# Altium schematic sheet MIDI_Synthesizer.SchDoc
size A2; SheetNumber: 1; SheetTotal: 2
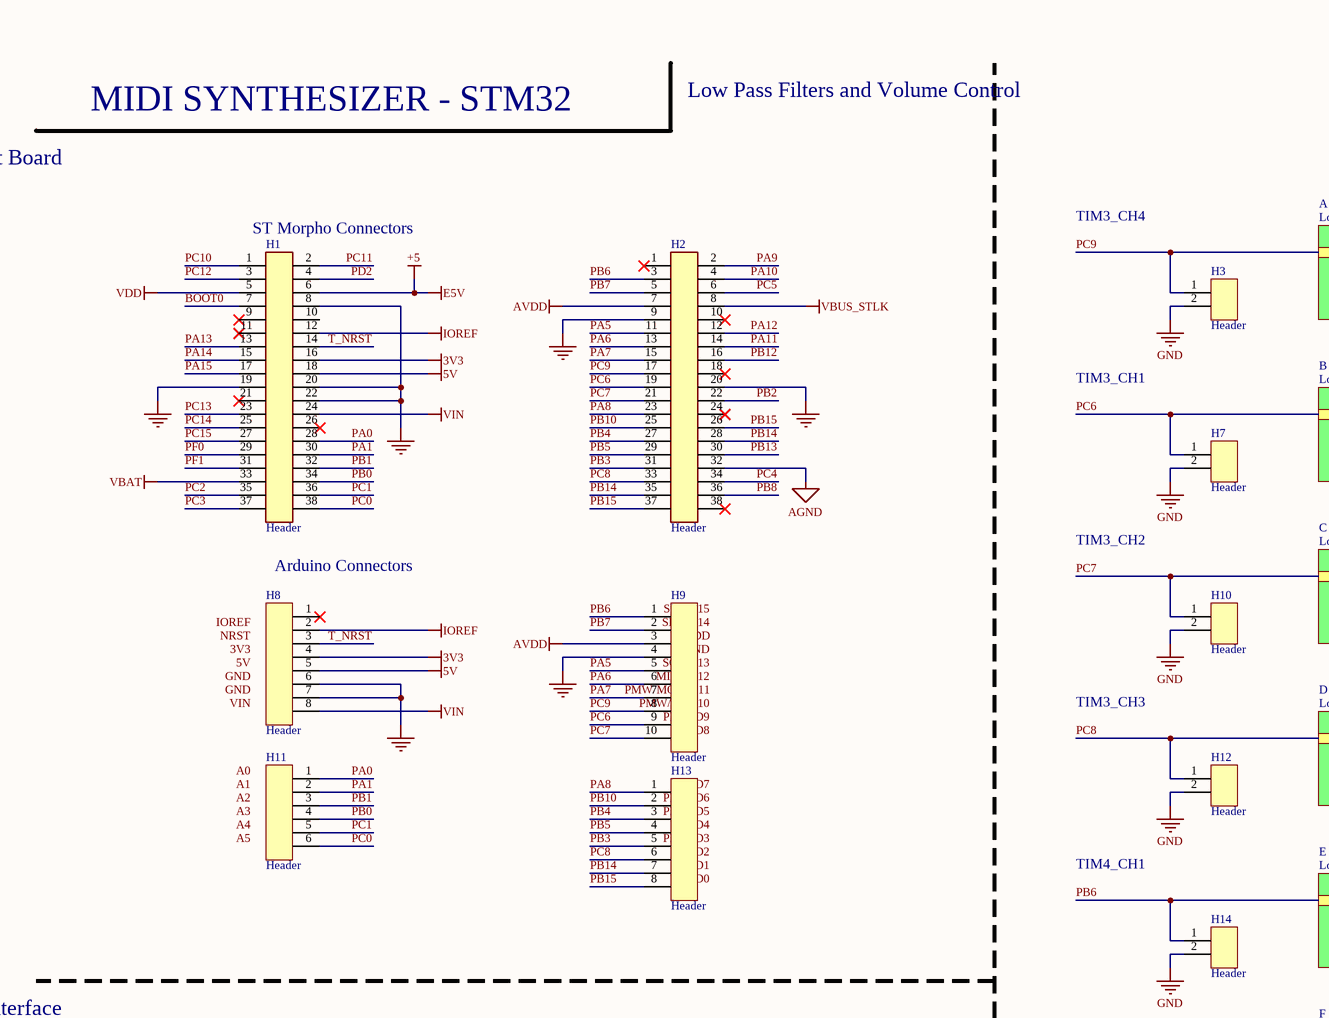
[diagram p0: MIDI_Synthesizer.SchDoc, top left]
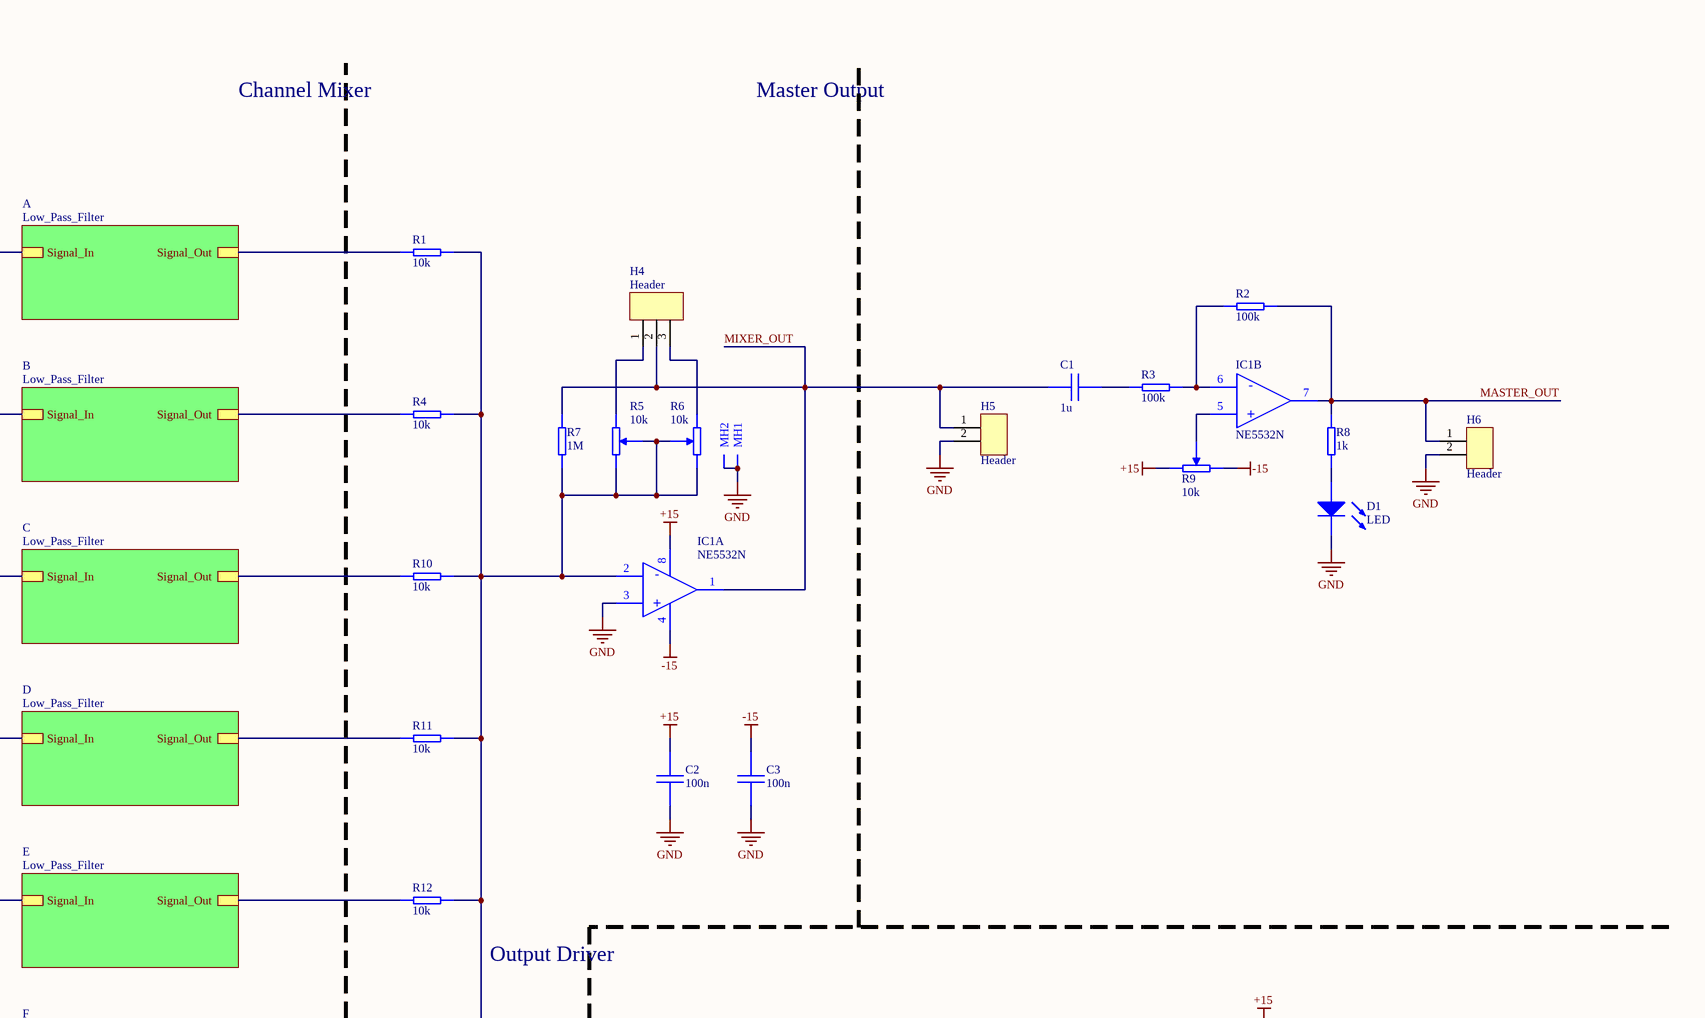
[diagram p1: MIDI_Synthesizer.SchDoc, top right]
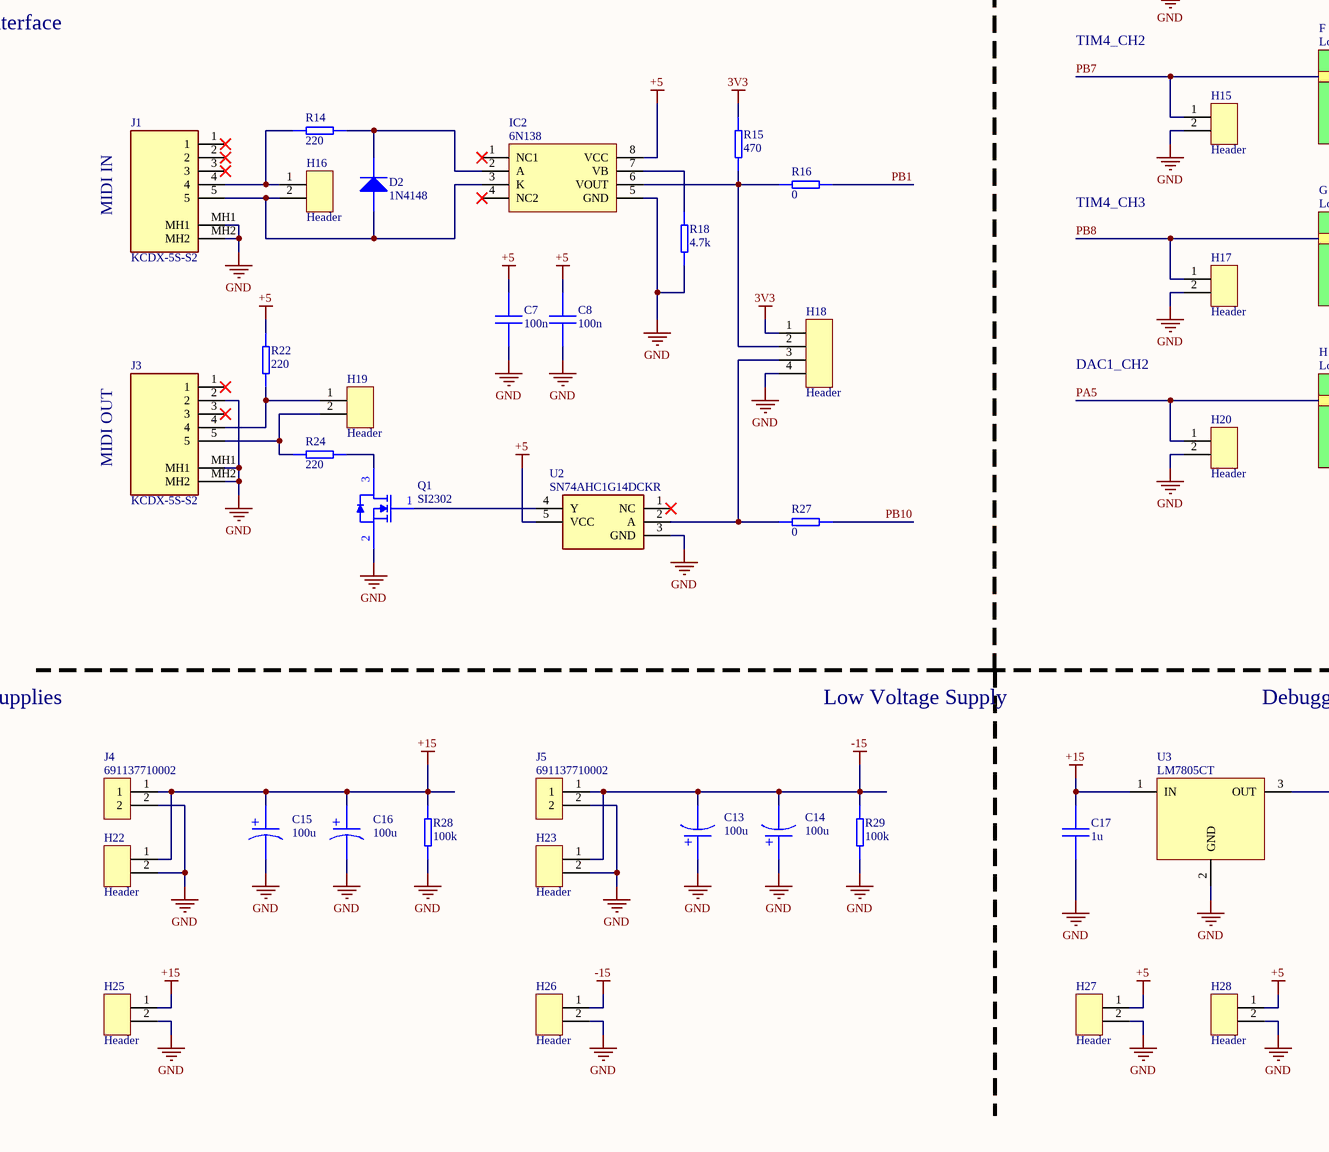
[diagram p2: MIDI_Synthesizer.SchDoc, bottom left]
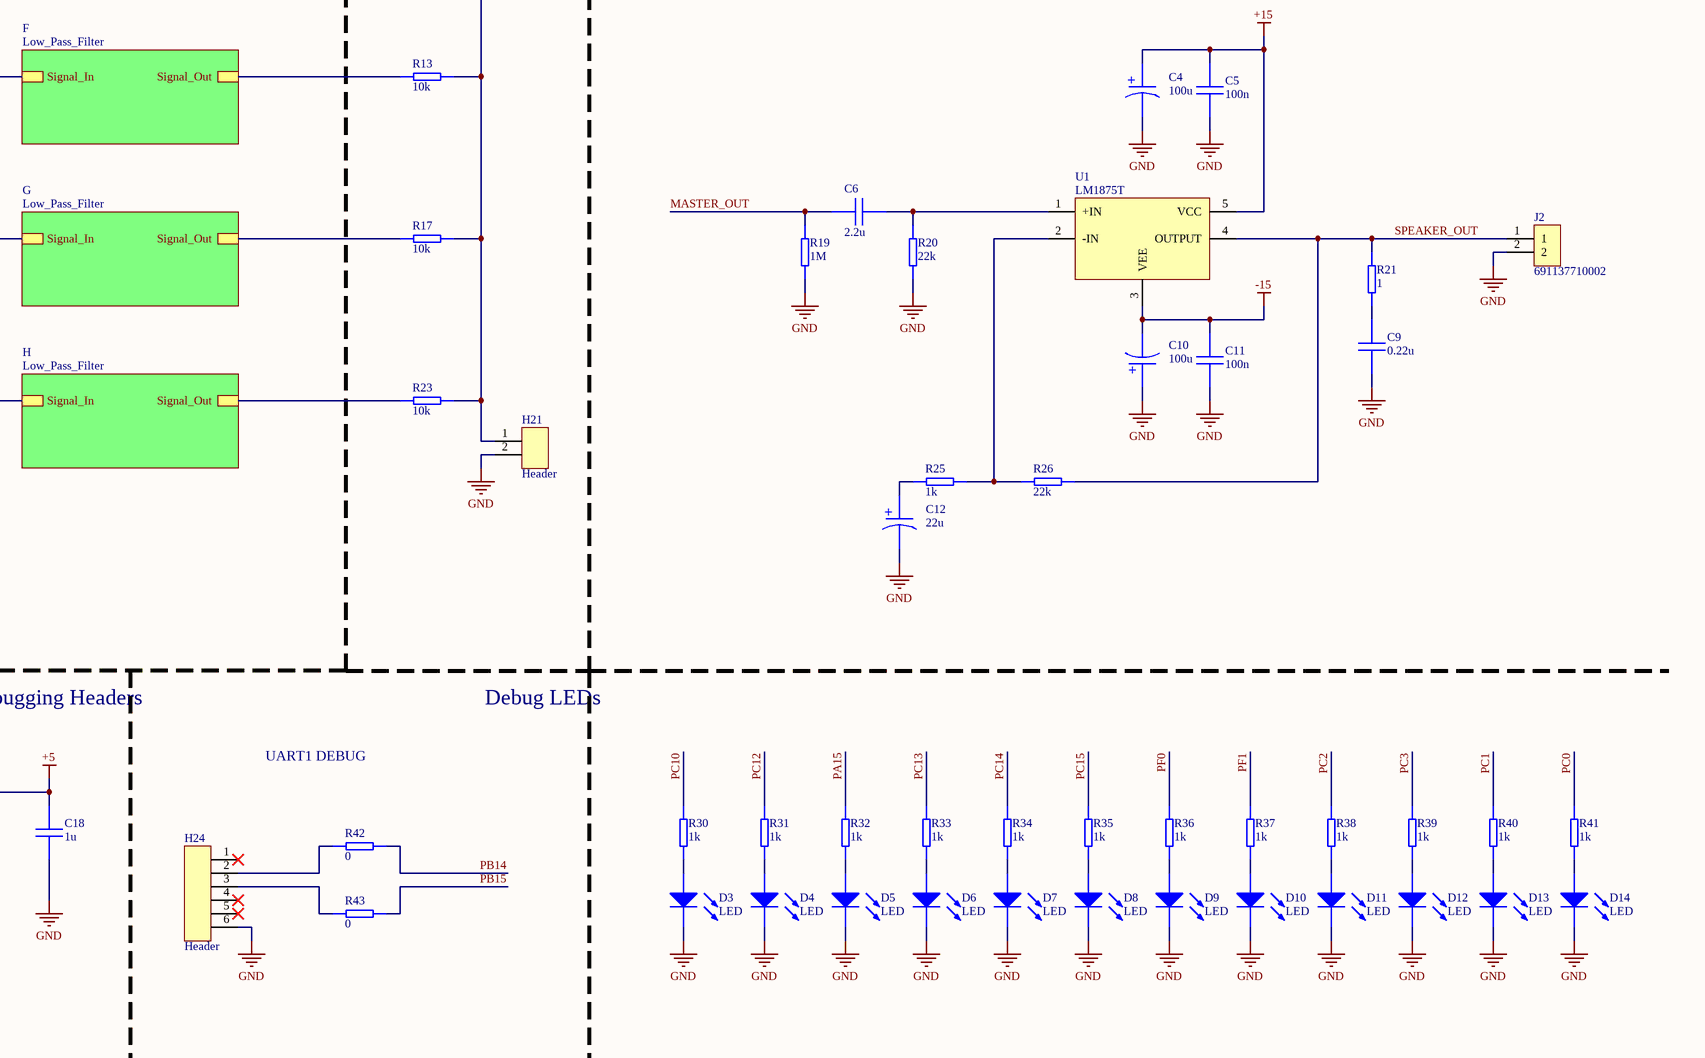
[diagram p3: MIDI_Synthesizer.SchDoc, bottom right]

## Parts
C1  1u  [CAP0805]
C2  100n  [CAP0805]
C3  100n  [CAP0805]
C4  100u  [CAPSMD660X800N]
C5  100n  [CAP0805]
C6  2.2u  [CAP0805]
C7  100n  [CAP0805]
C8  100n  [CAP0805]
C9  0.22u  [CAP0805]
C10  100u  [CAPSMD660X800N]
C11  100n  [CAP0805]
C12  22u  [CAPSMD530X550N]
C13  100u  [CAPSMD660X800N]
C14  100u  [CAPSMD660X800N]
C15  100u  [CAPSMD660X800N]
C16  100u  [CAPSMD660X800N]
C17  1u  [CAP0805]
C18  1u  [CAP0805]
D1  LED  [LEDM1608X90N]
D2  1N4148  [SOD123]
D3  LED  [LEDM1608X90N]
D4  LED  [LEDM1608X90N]
D5  LED  [LEDM1608X90N]
D6  LED  [LEDM1608X90N]
D7  LED  [LEDM1608X90N]
D8  LED  [LEDM1608X90N]
D9  LED  [LEDM1608X90N]
D10  LED  [LEDM1608X90N]
D11  LED  [LEDM1608X90N]
D12  LED  [LEDM1608X90N]
D13  LED  [LEDM1608X90N]
D14  LED  [LEDM1608X90N]
H1  Header  [HEADER_2X19]
H2  Header  [HEADER_2X19]
H3  Header  [Header_1X2]
H4  Header  [Header_1X3]
H5  Header  [Header_1X2]
H6  Header  [Header_1X2]
H7  Header  [Header_1X2]
H8  Header  [Header_1X8]
H9  Header  [Header_1X10]
H10  Header  [Header_1X2]
H11  Header  [Header_1X6]
H12  Header  [Header_1X2]
H13  Header  [Header_1X8]
H14  Header  [Header_1X2]
H15  Header  [Header_1X2]
H16  Header  [Header_1X2]
H17  Header  [Header_1X2]
H18  Header  [Header_1X4]
H19  Header  [Header_1X2]
H20  Header  [Header_1X2]
H21  Header  [Header_1X2]
H22  Header  [Header_1X2]
H23  Header  [Header_1X2]
H24  Header  [Header_1X6]
H25  Header  [Header_1X2]
H26  Header  [Header_1X2]
H27  Header  [Header_1X2]
H28  Header  [Header_1X2]
IC1  NE5532N  [DIP8]  (parts A,B of 2)
IC2  6N138  [DIP8]
J1  KCDX-5S-S2  [KCDX5SS2]
J2  691137710002  [SHDR2W70P0X500_1X2_1000X750X1160P]
J3  KCDX-5S-S2  [KCDX5SS2]
J4  691137710002  [SHDR2W70P0X500_1X2_1000X750X1160P]
J5  691137710002  [SHDR2W70P0X500_1X2_1000X750X1160P]
Q1  SI2302  [SOT23]
R1  10k  [RESC0805]
R2  100k  [RESC0805]
R3  100k  [RESC0805]
R4  10k  [RESC0805]
R5  10k  [Trim_Pot_Hybrid - No_Silk]
R6  10k  [PTV09A4015FB103]
R7  1M  [RESC0805]
R8  1k  [RESC0805]
R9  10k  [Trim_Pot_Hybrid - No_Silk]
R10  10k  [RESC0805]
R11  10k  [RESC0805]
R12  10k  [RESC0805]
R13  10k  [RESC0805]
R14  220  [RESC0805]
R15  470  [RESC0805]
R16  0  [RESC0805]
R17  10k  [RESC0805]
R18  4.7k  [RESC0805]
R19  1M  [RESC0805]
R20  22k  [RESC0805]
R21  1  [RESC0805]
R22  220  [RESC0805]
R23  10k  [RESC0805]
R24  220  [RESC0805]
R25  1k  [RESC0805]
R26  22k  [RESC0805]
R27  0  [RESC0805]
R28  100k  [RESC0805]
R29  100k  [RESC0805]
R30  1k  [RESC0805]
R31  1k  [RESC0805]
R32  1k  [RESC0805]
R33  1k  [RESC0805]
R34  1k  [RESC0805]
R35  1k  [RESC0805]
R36  1k  [RESC0805]
R37  1k  [RESC0805]
R38  1k  [RESC0805]
R39  1k  [RESC0805]
R40  1k  [RESC0805]
R41  1k  [RESC0805]
R42  0  [RESC0805]
R43  0  [RESC0805]
U1  LM1875T  [TO-220-5]
U2  SN74AHC1G14DCKR  [SC70-5]
U3  LM7805CT  [TO-220-3]

## Sub-sheets
A = Low_Pass_Filter: Signal_In, Signal_Out
B = Low_Pass_Filter: Signal_In, Signal_Out
C = Low_Pass_Filter: Signal_In, Signal_Out
D = Low_Pass_Filter: Signal_In, Signal_Out
E = Low_Pass_Filter: Signal_In, Signal_Out
F = Low_Pass_Filter: Signal_In, Signal_Out
G = Low_Pass_Filter: Signal_In, Signal_Out
H = Low_Pass_Filter: Signal_In, Signal_Out

## Nets
3V3: H1.16 H8.4 H18.1 R15.2
5V: H1.18 H8.5
+5: C7.2 C8.2 C18.2 H1.6 H27.1 H28.1 IC2.8(VCC) R22.2 U2.5(VCC) U3.3(OUT)  [also labelled E5V]
+15: C2.2 C4.1 C5.1 C15.1 C16.1 C17.2 H22.1 H25.1 IC1.8(V+) J4.1 R9.1 R28.1 U1.5(VCC) U3.1(IN)
-15: C3.2 C10.2 C11.2 C13.2 C14.2 H23.1 H26.1 IC1.4(V-) J5.1 R9.3 R29.1 U1.3(VEE)
AGND: H2.32
AVDD: H2.7 H9.3
GND: C2.1 C3.1 C4.2 C5.2 C7.1 C8.1 C9.1 C10.1 C11.1 C12.2 C13.1 C14.1 C15.2 C16.2 C17.1 C18.1 D1.1(K) D3.1(K) D4.1(K) D5.1(K) D6.1(K) D7.1(K) D8.1(K) D9.1(K) D10.1(K) D11.1(K) D12.1(K) D13.1(K) D14.1(K) H1.8 H1.19 H1.20 H1.22 H2.9 H2.20 H3.2 H5.2 H6.2 H7.2 H8.6 H8.7 H9.4 H10.2 H12.2 H14.2 H15.2 H17.2 H18.4 H20.2 H21.2 H22.2 H23.2 H24.6 H25.2 H26.2 H27.2 H28.2 IC1.3(+IN_A) IC2.5(GND) J1.MH1 J1.MH2 J2.2 J3.2 J3.MH1 J3.MH2 J4.2 J5.2 Q1.2(S) R6.4(MH1) R6.5(MH2) R18.1 R19.1 R20.1 R28.2 R29.2 U2.3(GND) U3.2(GND)
IOREF: H1.12 H8.2
VBAT: H1.33
VBUS_STLK: H2.8
VDD: H1.5
VIN: H1.24 H8.8
BOOT0: H1.7
MASTER_OUT: C6.2 H6.1 IC1.7(OUT_B) R2.1 R8.1 R19.2
MIXER_OUT: C1.1 H4.2 H5.1 IC1.1(OUT_A) R7.1
PA0: H1.28 H11.1
PA1: H1.30 H11.2
PA5: H2.11 H9.5 H20.1 ; sheet H/Signal_In
PA6: H2.13 H9.6
PA7: H2.15 H9.7
PA8: H2.23 H13.1
PA9: H2.2
PA10: H2.4
PA11: H2.14
PA12: H2.12
PA13: H1.13
PA14: H1.15
PA15: H1.17 R32.1
PB0: H1.34 H11.4
PB1: H1.32 H11.3 R16.2
PB2: H2.22
PB3: H2.31 H13.5
PB4: H2.27 H13.3
PB5: H2.29 H13.4
PB6: H2.3 H9.1 H14.1 ; sheet E/Signal_In
PB7: H2.5 H9.2 H15.1 ; sheet F/Signal_In
PB8: H2.36 H17.1 ; sheet G/Signal_In
PB10: H2.25 H13.2 R27.2
PB12: H2.16
PB13: H2.30
PB14: H2.28 H2.35 H13.7 R42.2
PB15: H2.26 H2.37 H13.8 R43.2
PC0: H1.38 H11.6 R41.1
PC1: H1.36 H11.5 R40.1
PC2: H1.35 R38.1
PC3: H1.37 R39.1
PC4: H2.34
PC5: H2.6
PC6: H2.19 H7.1 H9.9 ; sheet B/Signal_In
PC7: H2.21 H9.10 H10.1 ; sheet C/Signal_In
PC8: H2.33 H12.1 H13.6 ; sheet D/Signal_In
PC9: H2.17 H3.1 H9.8 ; sheet A/Signal_In
PC10: H1.1 R30.1
PC11: H1.2
PC12: H1.3 R31.1
PC13: H1.23 R33.1
PC14: H1.25 R34.1
PC15: H1.27 R35.1
PD2: H1.4
PF0: H1.29 R36.1
PF1: H1.31 R37.1
SPEAKER_OUT: J2.1 R21.2 R26.1 U1.4(OUTPUT)
T_NRST: H1.14 H8.3
NetC1_2: C1.2 R3.2
NetC6_1: C6.1 R20.2 U1.1(+IN)
NetC9_2: C9.2 R21.1
NetC12_1: C12.1 R25.1
NetD1_2: D1.2(A) R8.2
NetD2_1: D2.1(K) IC2.2(A) R14.2
NetD2_2: D2.2(A) H16.2 IC2.3(K) J1.5
NetD3_2: D3.2(A) R30.2
NetD4_2: D4.2(A) R31.2
NetD5_2: D5.2(A) R32.2
NetD6_2: D6.2(A) R33.2
NetD7_2: D7.2(A) R34.2
NetD8_2: D8.2(A) R35.2
NetD9_2: D9.2(A) R36.2
NetD10_2: D10.2(A) R37.2
NetD11_2: D11.2(A) R38.2
NetD12_2: D12.2(A) R39.2
NetD13_2: D13.2(A) R40.2
NetD14_2: D14.2(A) R41.2
NetH4_1: H4.1 R5.1
NetH4_3: H4.3 R6.1
NetH16_1: H16.1 J1.4 R14.1
NetH18_2: H18.2 IC2.6(VOUT) R15.1 R16.1
NetH18_3: H18.3 R27.1 U2.2(A)
NetH19_1: H19.1 J3.4 R22.1
NetH19_2: H19.2 J3.5 R24.2
NetH21_1: H21.1 IC1.2(-IN_A) R1.2 R4.2 R5.2 R5.3 R6.2 R6.3 R7.2 R10.2 R11.2 R12.2 R13.2 R17.2 R23.2
NetH24_2: H24.2 R42.1
NetH24_3: H24.3 R43.1
NetIC1_5: IC1.5(+IN_B) R9.2
NetIC1_6: IC1.6(-IN_B) R2.2 R3.1
NetIC2_7: IC2.7(VB) R18.2
NetQ1_1: Q1.1(G) U2.4(Y)
NetQ1_3: Q1.3(D) R24.1
NetR1_1: R1.1 ; sheet A/Signal_Out
NetR4_1: R4.1 ; sheet B/Signal_Out
NetR10_1: R10.1 ; sheet C/Signal_Out
NetR11_1: R11.1 ; sheet D/Signal_Out
NetR12_1: R12.1 ; sheet E/Signal_Out
NetR13_1: R13.1 ; sheet F/Signal_Out
NetR17_1: R17.1 ; sheet G/Signal_Out
NetR23_1: R23.1 ; sheet H/Signal_Out
NetR25_2: R25.2 R26.2 U1.2(-IN)

Not connected (* = marked no-connect by the designer): H1 9* 10 11* 21* 26*; H2 1* 10* 18* 24* 38*; H8 1*; H24 1* 4* 5*; IC2 1(NC1)* 4(NC2)*; J1 1* 2* 3*; J3 1* 3*; U2 1(NC)*

## Notes on the sheet
- MIDI SYNTHESIZER - STM32
- Low Pass Filters and Volume Control
- Channel Mixer
- Master Output
- NUCLEO-H533RE Development Board
- ST Morpho Connectors
- TIM3_CH4
- TIM3_CH1
- TIM3_CH2
- Arduino Connectors
- (near H9) SCL/D15
- (near H8) GND
- (near H8) 5V
- (near H8) 3V3
- (near H8) NRST
- (near H8) IOREF
- (near H9) SDA/D14
- (near H9) SCK/D13
- (near H9) MISO/D12
- (near H9) AVDD
- (near H9) GND
- (near H8) VIN
- (near H9) D8
- (near H9) PMW/D9
- (near H9) PMW/CS/D10
- (near H9) PMW/MOSI/D11
- TIM3_CH3
- (near H11) A0
- (near H11) A1
- (near H11) A2
- (near H11) A3
- (near H13) PMW/D5
- (near H13) PMW/D6
- D7
- (near H11) A4
- (near H11) A5
- (near H13) RX/D0
- (near H13) TX/D1
- (near H13) D2
- (near H13) D4
- (near H13) PMW/D3
- TIM4_CH1
- MIDI Interface
- Output Driver
- TIM4_CH2
- MIDI IN
- TIM4_CH3
- DAC1_CH2
- MIDI OUT
- Power Supplies
- Low Voltage Supply
- Debugging Headers
- Debug LEDs
- UART1 DEBUG
- (in symbol Capacitor - Polarized) +
- (in symbol NE5532N, part A) -; +
- (in symbol NE5532N, part B) -; +

## Library data of the parts
C1-C3 C5-C9 C11 C17 C18 = Capacitor - Non Polarized: Non Polarized Capacitor
C4 C10 C12-C16 = Capacitor - Polarized: Polarized Capacitor
D1 D3-D14 = LED: General Purpose LED; ComponentLink1Description: Datasheet; ComponentLink1URL: https://www.smc-diodes.com/propdf/1N4148W%20N0571%20REV.E.pdf
D2 = 1N4148: 1N4148 General Purpose Switching Diode; ComponentLink1Description: Datasheet; ComponentLink1URL: https://www.smc-diodes.com/propdf/1N4148W%20N0571%20REV.E.pdf
H1 H2 = 38-Pin Header (19x2): 38-Pin 2 Row Header
H3 H5-H7 H10 H12 H14-H17 H19-H23 H25-H28 = 2-Pin Header
H4 = 3-Pin Header
H8 H13 = 8-Pin Header
H9 = 10-Pin Header
H11 H24 = 6-Pin Header
H18 = 4-Pin Header
IC1 = NE5532N: Integrated Circuit; Manufacturer_Name: onsemi; Datasheet Link: http://www.onsemi.com/pub/Collateral/NE5532-D.PDF; Height: 5.33mm; Manufacturer_Part_Number: NE5532N; Mouser Part Number: 863-NE5532N; Mouser Price/Stock: https://www.mouser.co.uk/ProductDetail/onsemi/NE5532N?qs=8sOby8ZxZLFYqQ84pMQPGQ%3D%3D
IC2 = 6N138: Integrated Circuit; Manufacturer_Name: Vishay; Datasheet Link: https://componentsearchengine.com/Datasheets/2/6N138.pdf; Height: 4.8mm; Manufacturer_Part_Number: 6N138; Mouser Part Number: 782-6N138; Mouser Price/Stock: https://www.mouser.co.uk/ProductDetail/Vishay-Semiconductors/6N138?qs=IOh0O5QtZ922Jk5VFSbX4w%3D%3D; Arrow Part Number: 6N138; Arrow Price/Stock: https://www.arrow.com/en/products/6n138/vishay
J1 J3 = KCDX-5S-S2: Connector; Manufacturer_Name: Kycon; Datasheet Link: http://www.kycon.com/Pub_Eng_Draw/KCDX-5S-S2.pdf; Height: 21.2mm; Manufacturer_Part_Number: KCDX-5S-S2; Mouser Part Number: 806-KCDX-5S-S2; Mouser Price/Stock: https://www.mouser.co.uk/ProductDetail/Kycon/KCDX-5S-S2?qs=Hyo%2FOIDW0pNotQHJom5wpw%3D%3D
J2 J4 J5 = 691137710002: Connector; Manufacturer_Name: Wurth Elektronik; Datasheet Link: https://katalog.we-online.com/em/datasheet/691137710002.pdf; Height: 11.6mm; Manufacturer_Part_Number: 691137710002; Mouser Part Number: 710-691137710002; Mouser Price/Stock: https://www.mouser.co.uk/ProductDetail/Wurth-Elektronik/691137710002?qs=lBTPRtX1sU9LnHBbviNKGA%3D%3D
Q1 = SI2302: General Purpose N-Channel MOSFET; ComponentLink1Description: Datasheet; ComponentLink1URL: https://www.mccsemi.com/pdf/Products/BSS138(SOT-23).pdf
R1-R4 R7 R8 R10-R43 = Resistor
R5 R9 = Potentiometer: Potentionmeter
R6 = Potentiometer_Mounted: Potentionmeter
U1 = LM1875T: Integrated Circuit; Manufacturer_Name: Texas Instruments; Manufacturer_Part_Number: LM1875T/NOPB; Datasheet Link: https://datasheet.lcsc.com/szlcsc/Texas-Instruments-TI-LM1875T-NOPB_C9666.pdf; Height: 4.7mm; Mouser Part Number: 926-LM1875T/NOPB; Mouser Price/Stock: https://www.mouser.co.uk/ProductDetail/Texas-Instruments/LM1875T-NOPB?qs=X1J7HmVL2ZFo7ifmvYS%252B%252Bw%3D%3D; Arrow Part Number: LM1875T/NOPB; Arrow Price/Stock: https://www.arrow.com/en/products/lm1875tnopb/texas-instruments?region=europe
U2 = SN74AHC1G14DCKR: Integrated Circuit; Manufacturer_Name: Texas Instruments; Datasheet Link: http://www.ti.com/lit/ds/symlink/sn74ahc1g14.pdf; Height: 1.1mm; Manufacturer_Part_Number: SN74AHC1G14DCKR; Mouser Part Number: 595-SN74AHC1G14DCKR; Mouser Price/Stock: https://www.mouser.co.uk/ProductDetail/Texas-Instruments/SN74AHC1G14DCKR?qs=YhsVCygOPE3cGMcDGKIISg%3D%3D; Arrow Part Number: SN74AHC1G14DCKR; Arrow Price/Stock: https://www.arrow.com/en/products/sn74ahc1g14dckr/texas-instruments?utm_currency=USD&region=nac
U3 = LM7805CT: Integrated Circuit; Manufacturer_Name: Texas Instruments; Datasheet Link: http://www.ti.com/lit/ds/symlink/lm340.pdf; Height: 4.7mm; Manufacturer_Part_Number: LM7805CT; Mouser Part Number: 926-LM7805CT; Mouser Price/Stock: https://www.mouser.co.uk/ProductDetail/Texas-Instruments/LM7805CT?qs=QbsRYf82W3EaqXeMDVwIfQ%3D%3D; Arrow Part Number: LM7805CT; Arrow Price/Stock: https://www.arrow.com/en/products/lm7805ct/texas-instruments?region=europe